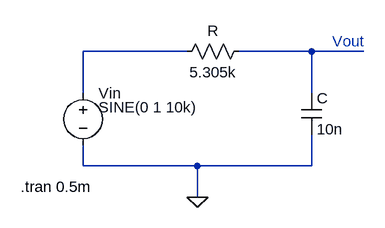
[diagram p0: schematic lpf.asc]
lpf.asc, the LTspice schematic file:
Version 4
SHEET 1 880 680
WIRE 272 256 112 256
WIRE 464 256 352 256
WIRE 544 256 464 256
WIRE 112 320 112 256
WIRE 464 320 464 256
WIRE 112 432 112 400
WIRE 288 432 112 432
WIRE 464 432 464 384
WIRE 464 432 288 432
WIRE 288 480 288 432
FLAG 288 480 0
SYMBOL voltage 112 304 R0
WINDOW 3 24 38 Left 2
SYMATTR InstName Vin
SYMATTR Value SINE(0 1 10k)
SYMBOL Res 368 240 R90
WINDOW 0 0 56 VBottom 2
WINDOW 3 32 56 VTop 2
SYMATTR InstName R
SYMATTR Value 5.305k
SYMBOL Cap 448 320 R0
SYMATTR InstName C
SYMATTR Value 10n
TEXT 496 240 Left 2 ;Vout
TEXT 16 464 Left 2 !.tran 0.5m

The netlist it stands for:
* lpf.asc
Vin N001 0 SINE(0 1 10k)
R N002 N001 5.305k
C N002 0 10n
* Vout
.tran 0.5m
.backanno
.end